# EAGLE schematic CAN (EAGLE 7.2.0)
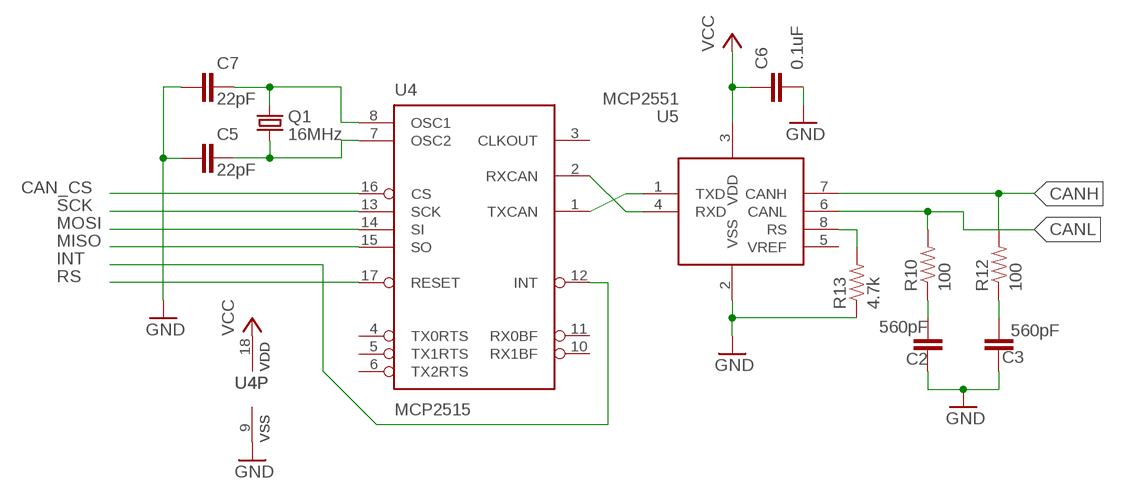
[diagram p0: schematic, sheet 1]

## Parts
C2  560pF  CAP0603-CAP  [0603-CAP]
C3  560pF  CAP0603-CAP  [0603-CAP]
C5  22pF  CAP0603-CAP  [0603-CAP]
C6  0.1uF  CAP0603-CAP  [0603-CAP]
C7  22pF  CAP0603-CAP  [0603-CAP]
Q1  16MHz  CRYSTAL5X3  [CRYSTAL-SMD-5X3]
R10  100  RESISTOR0603-RES  [0603-RES]
R12  100  RESISTOR0603-RES  [0603-RES]
R13  4.7k  RESISTOR0603-RES  [0603-RES]
U4  MCP2515  MCP2510SO  [SO-18W]
U5  MCP2551  [SO-08M]

## Nets
CAN_CS: U4.16(CS)
CANH: R12.2 U5.7(CANH)
CANL: R10.2 U5.6(CANL)
GND: C2.1 C3.1 C5.1 C6.1 C7.1 R13.1 U4.9(VSS) U5.2(VSS)
INT: U4.12(INT)
MISO: U4.15(SO)
MOSI: U4.14(SI)
N$1: U4.2(RXCAN) U5.4(RXD)
N$2: U4.1(TXCAN) U5.1(TXD)
N$9: C2.2 R10.1
N$10: C3.2 R12.1
N$14: R13.2 U5.8(RS)
N$17: C7.2 Q1.3 U4.8(OSC1)
N$18: C5.2 Q1.1 U4.7(OSC2)
RS: U4.17(RESET)
SCK: U4.13(SCK)
VCC: C6.2 U4.18(VDD) U5.3(VDD)
Unconnected: U4.3(CLKOUT) U4.4(TX0RTS) U4.5(TX1RTS) U4.6(TX2RTS) U4.10(RX1BF) U4.11(RX0BF) U5.5(VREF)

## Library data of the parts
C2 C3 C5-C7 = SparkFun:CAP: Capacitor Standard 0603 ceramic capacitor, and 0.1" leaded capacitor.
Q1 = SparkFun:CRYSTAL: Crystals Various standard crystals. Proven footprints. Spark Fun Electronics SKU : COM-00534
R10 R12 R13 = SparkFun:RESISTOR: Resistor Basic schematic elements and footprints for 0603, 1206, and PTH resistors.
U4 = microchip_can:MCP2510
U5 = skpang_lib:MCP2551